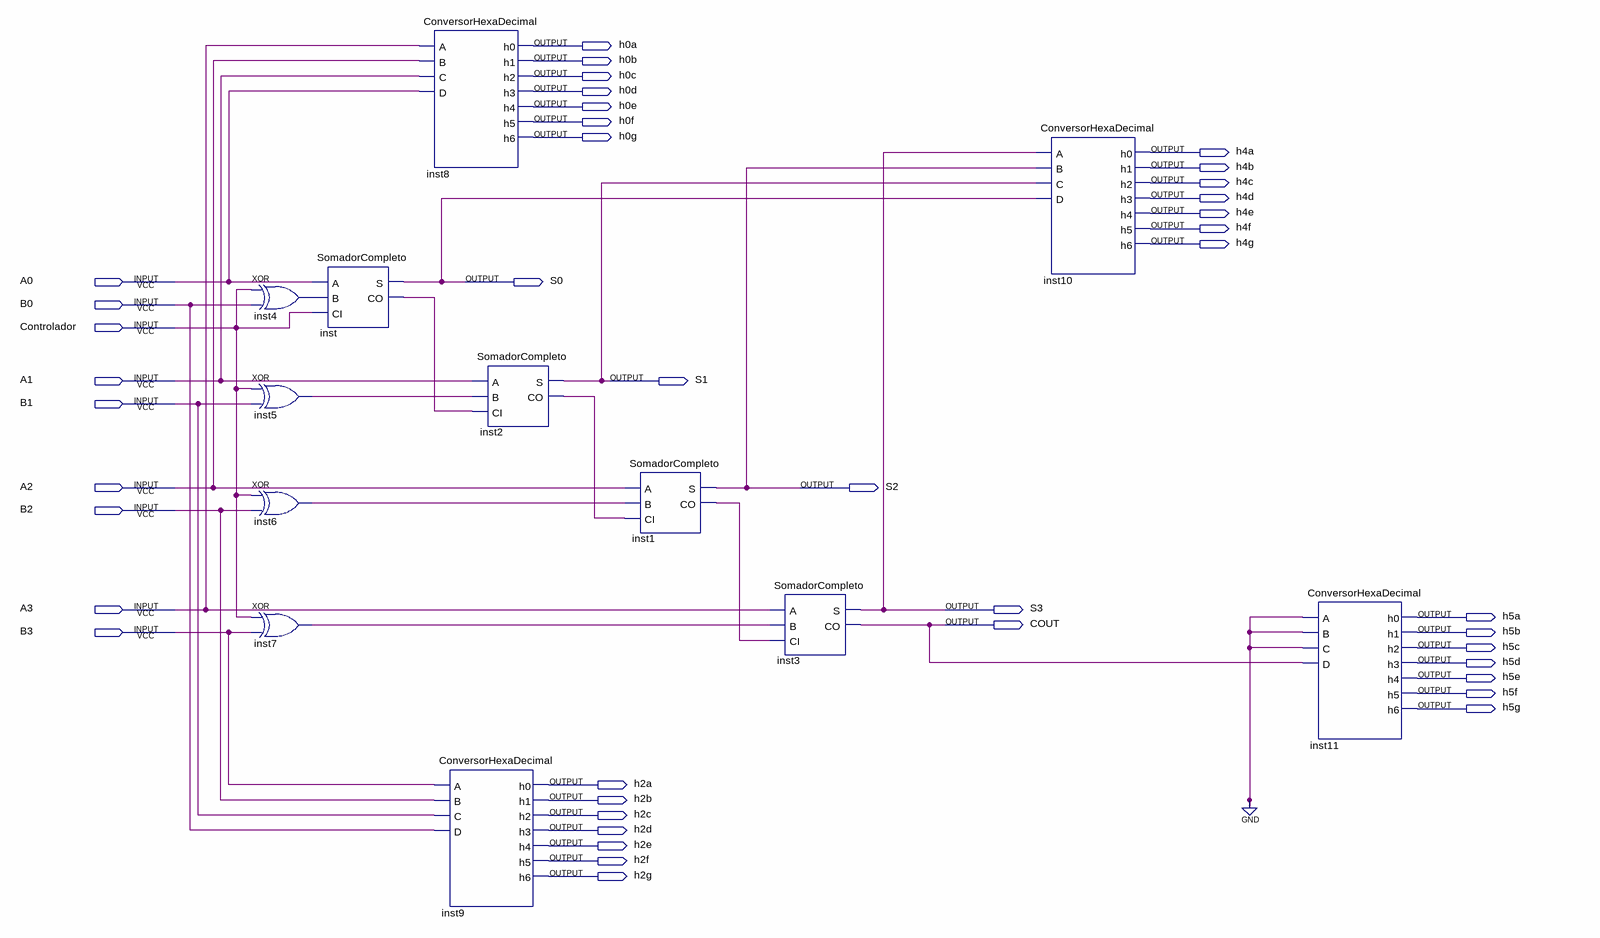
[diagram p0: schematic sheet]
// Quartus schematic SomadorSubtrator.bdf as structural Verilog: 12 symbols, 42 pins
module SomadorSubtrator (
  input  A0,
  input  B0,
  input  Controlador,
  input  A1,
  input  B1,
  input  A2,
  input  B2,
  input  A3,
  input  B3,
  output h0a,
  output h0b,
  output h0c,
  output h0d,
  output h0e,
  output h0f,
  output h0g,
  output h4a,
  output h4b,
  output h4c,
  output h4d,
  output h4e,
  output h4f,
  output h4g,
  output S0,
  output S1,
  output S2,
  output S3,
  output h5a,
  output COUT,
  output h5b,
  output h5c,
  output h5d,
  output h5e,
  output h5f,
  output h5g,
  output h2a,
  output h2b,
  output h2c,
  output h2d,
  output h2e,
  output h2f,
  output h2g
);

  wire inst1_co, inst2_co, inst4_out, inst5_out, inst6_out, inst7_out, inst_co;

  xor inst4 (inst4_out, Controlador, B0);
  xor inst5 (inst5_out, Controlador, B1);
  xor inst6 (inst6_out, Controlador, B2);
  xor inst7 (inst7_out, Controlador, B3);
  SomadorCompleto inst (.A(A0), .B(inst4_out), .CI(Controlador), .S(S0), .CO(inst_co));
  ConversorHexaDecimal inst8 (
    .A(A3), .B(A2), .C(A1), .D(A0), .h0(h0a), .h1(h0b), .h2(h0c), .h3(h0d), .h4(h0e), .h5(h0f), .h6(h0g));
  SomadorCompleto inst2 (.A(A1), .B(inst5_out), .CI(inst_co), .S(S1), .CO(inst2_co));
  ConversorHexaDecimal inst9 (
    .A(B3), .B(B2), .C(B1), .D(B0), .h0(h2a), .h1(h2b), .h2(h2c), .h3(h2d), .h4(h2e), .h5(h2f), .h6(h2g));
  SomadorCompleto inst1 (.A(A2), .B(inst6_out), .CI(inst2_co), .S(S2), .CO(inst1_co));
  SomadorCompleto inst3 (.A(A3), .B(inst7_out), .CI(inst1_co), .S(S3), .CO(COUT));
  ConversorHexaDecimal inst10 (
    .A(S3), .B(S2), .C(S1), .D(S0), .h0(h4a), .h1(h4b), .h2(h4c), .h3(h4d), .h4(h4e), .h5(h4f), .h6(h4g));
  ConversorHexaDecimal inst11 (
    .A(1'b0), .B(1'b0), .C(1'b0), .D(COUT), .h0(h5a), .h1(h5b), .h2(h5c), .h3(h5d), .h4(h5e), .h5(h5f),
    .h6(h5g));
endmodule
